# Altium project uARM.PrjPcb
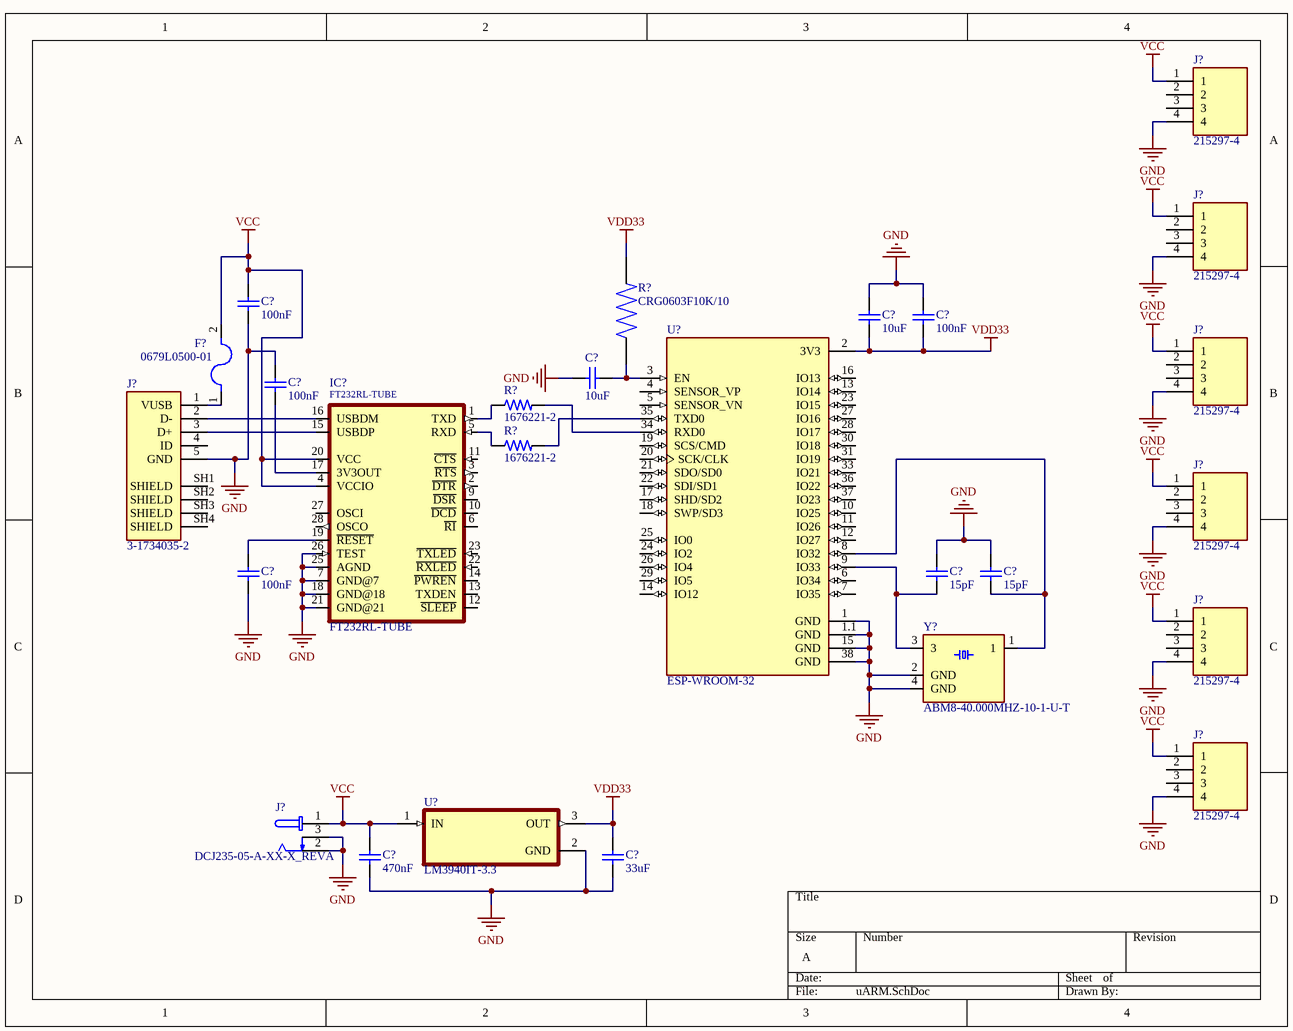
[diagram p0: uARM.SchDoc]
1 sheet, 26 parts. Net scope: global (net labels, ports and power ports of the same name join across sheets).

## Sheet uARM.SchDoc
size A

### Parts
(Parts that share a designator on the sheet are numbered #1, #2 ... from top to bottom, then left to right.)
C?#1  value 100nF  [C_3216[1206]_N]  (hidden comment: C1206C106K3RACTU)
C?#2  value 10uF  [C_3216[1206]_N]  (hidden comment: C1206C106K3RACTU)
C?#3  value 100nF  [C_3216[1206]_N]  (hidden comment: C1206C106K3RACTU)
C?#4  value 100nF  [C_3216[1206]_N]  (hidden comment: C1206C106K3RACTU)
C?#5  value 10uF  [C_3216[1206]_N]  (hidden comment: C1206C106K3RACTU)
C?#6  value 100nF  [C_3216[1206]_N]  (hidden comment: C1206C106K3RACTU)
C?#7  value 15pF  [C_3216[1206]_N]  (hidden comment: C1206C106K3RACTU)
C?#8  value 15pF  [C_3216[1206]_N]  (hidden comment: C1206C106K3RACTU)
C?#9  value 470nF  [C_3216[1206]_N]  (hidden comment: C1206C106K3RACTU)
C?#10  value 33uF  [C_3216[1206]_N]  (hidden comment: C1206C106K3RACTU)
F?  0679L0500-01  [FUSC6125X279N]
IC?  FT232RL-TUBE  [SSOP28-LD]
J?#1  215297-4  [TE_215297-4]
J?#2  215297-4  [TE_215297-4]
J?#3  215297-4  [TE_215297-4]
J?#4  3-1734035-2  [TE_3-1734035-2]
J?#5  215297-4  [TE_215297-4]
J?#6  215297-4  [TE_215297-4]
J?#7  215297-4  [TE_215297-4]
J?#8  DCJ235-05-A-XX-X_REVA  [GCT_DCJ235-05-A-XX-X_REVA]
R?#1  CRG0603F10K/10  [RESC1608X55N]
R?#2  1676221-2  [RESC2012X65N]
R?#3  1676221-2  [RESC2012X65N]
U?#1  ESP-WROOM-32  [MODULE_ESP-WROOM-32]
U?#2  LM3940IT-3.3  [TO254P1054X470X1955-3]
Y?  ABM8-40.000MHZ-10-1-U-T  [OSCSC320X250X100N]

### Nets
GND: C?#1.2 C?#2.2 C?#3.2 C?#4.1 C?#5.2 C?#6.2 C?#7.1 C?#8.1 C?#9.2 C?#10.2 IC?.7(GND@7) IC?.18(GND@18) IC?.21(GND@21) IC?.25(AGND) IC?.26(TEST) J?#1.4 J?#2.4 J?#3.4 J?#4.5(GND) J?#5.4 J?#6.4 J?#7.4 J?#8.2 J?#8.3 U?#1.1(GND) U?#1.1.1(GND) U?#1.15(GND) U?#1.38(GND) U?#2.2(GND) Y?.2(GND) Y?.4(GND)
VCC: C?#1.1 C?#9.1 F?.2 IC?.4(VCCIO) IC?.20(VCC) J?#1.1 J?#2.1 J?#3.1 J?#5.1 J?#6.1 J?#7.1 J?#8.1 U?#2.1(IN)
VDD33: C?#2.1 C?#3.1 C?#10.1 R?#1.2 U?#1.2(3V3) U?#2.3(OUT)
NetC?#4_2: C?#4.2 IC?.17(3V3OUT)
NetC?#5_1: C?#5.1 R?#1.1 U?#1.3(EN)
NetC?#6_1: C?#6.1 IC?.19(~{RESET})
NetC?#7_2: C?#7.2 U?#1.9(IO33) Y?.3
NetC?#8_2: C?#8.2 U?#1.8(IO32) Y?.1
NetF?_1: F?.1 J?#4.1(VUSB)
NetIC?_1: IC?.1(TXD) R?#2.1
NetIC?_5: IC?.5(RXD) R?#3.1
NetIC?_15: IC?.15(USBDP) J?#4.3(D+)
NetIC?_16: IC?.16(USBDM) J?#4.2(D-)
NetR?#2_2: R?#2.2 U?#1.34(RXD0)
NetR?#3_2: R?#3.2 U?#1.35(TXD0)

Not connected (* = marked no-connect by the designer): IC? 2(~{DTR}) 3(~{RTS}) 6(~{RI}) 9(~{DSR}) 10(~{DCD}) 11(~{CTS}) 12(~{SLEEP}) 13(TXDEN) 14(~{PWREN}) 22(~{RXLED}) 23(~{TXLED}) 27(OSCI) 28(OSCO); J?#1 2 3; J?#2 2 3; J?#3 2 3; J?#4 4(ID) SH1(SHIELD) SH2(SHIELD) SH3(SHIELD) SH4(SHIELD); J?#5 2 3; J?#6 2 3; J?#7 2 3; U?#1 4(SENSOR_VP) 5(SENSOR_VN) 6(IO34) 7(IO35) 10(IO25) 11(IO26) 12(IO27) 13(IO14) 14(IO12) 16(IO13) 17(SHD/SD2) 18(SWP/SD3) 19(SCS/CMD) 20(SCK/CLK) 21(SDO/SD0) 22(SDI/SD1) 23(IO15) 24(IO2) 25(IO0) 26(IO4) 27(IO16) 28(IO17) 29(IO5) 30(IO18) 31(IO19) 33(IO21) 36(IO22) 37(IO23)

### Library data of the parts
C?#1-C?#10 = C_10uf_3216[1206]: Capacitor Céramique 10uf XR7 25V 10%; Manufacturer: KEMET; ManufacturerPartNumber: C1206C106K3RACTU; Supplier 1: Digi-Key; Supplier Part Number 1: 399-7442-1-ND; MountingType: SMT
F? = 0679L0500-01: 2410 SMT Fuse | Quick Acting | 250mA | Higher AC Voltage; MF: {'manufacturer': u'Bel Fuse'}; MP: 0679L0500-01; Value: *; Price: None; Package: None; Availability: Unavailable
IC? = FT232RL-TUBE: MF: {'manufacturer': u'FTDI,'}; Value: *; MP: FT232RL-TUBE; Availability: Unavailable; Price: None; Package: None
J?#1-J?#3 J?#5-J?#7 = 215297-4: MF: {'manufacturer': u'TE Connectivity'}; Package: None; Price: None; Availability: Unavailable; MP: 215297-4; Value: *
J?#4 = 3-1734035-2: USB Connectors MINI USB, R/A, SMT, MATTE TIN, W/O MYLAR; MF: {'manufacturer': u'TE Connectivity'}; Value: *; MP: 3-1734035-2; Availability: Unavailable; Price: None; Package: None
J?#8 = DCJ235-05-A-XX-X_REVA: DC Power Jack, Thru-Hole, Horizontal, with Locating Pegs, D2.35mm; MF: {'manufacturer': u'Global Connector Technology'}; Availability: Unavailable; Package: None; Price: None; MP: DCJ235-05-A-XX-X_REVA; Value: *
R?#1 = CRG0603F10K/10: Thick Film Resistors - SMD CRG0603 1% 10K 10K RL; MF: {'manufacturer': u'TE Connectivity'}; Value: *; Price: None; MP: CRG0603F10K/10; Package: None; Availability: Unavailable
R?#2 R?#3 = 1676221-2: RN 0805 1K0 0.1% 10PPM 1KRL; MF: {'manufacturer': u'TE Connectivity'}; Value: *; Price: None; MP: 1676221-2; Package: None; Availability: Unavailable
U?#1 = ESP-WROOM-32: Module: combo; GPIO, I2C x2, I2S x2, SDIO, SPI x3, UART x3; 19.5dBm; MF: {'manufacturer': u'Espressif Systems'}; Availability: Unavailable; MP: ESP-WROOM-32; Value: *; Price: None; Package: None
U?#2 = LM3940IT-3.3: MF: {'manufacturer': u'Texas Instruments'}; Availability: Unavailable; MP: LM3940IT-3.3; Price: None; Value: *; Package: None
Y? = ABM8-40.000MHZ-10-1-U-T: Crystal 20MHz Ã‚Â±20ppm (Tol) Ã‚Â±30ppm (Stability) 18pF FUND 80Ohm 4-Pin Mini-CSMD T/R; MF: {'manufacturer': u'Abracon'}; Availability: Unavailable; Value: *; Package: None; MP: ABM8-40.000MHZ-10-1-U-T; Price: None